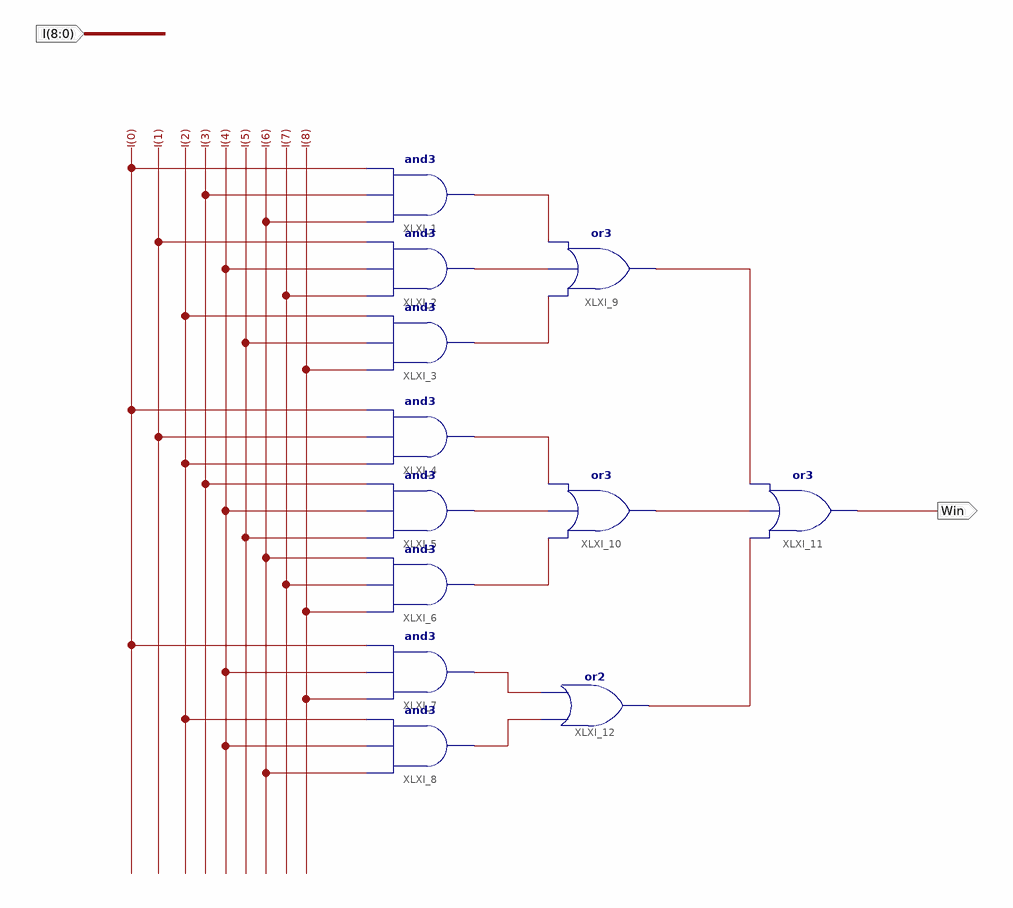
[diagram p0: schematic sheet 1]
// Xilinx ISE schematic checkWin.sch (spartan6) as structural Verilog: 12 symbols, 2 ports
module checkWin (
  input  [8:0] I,
  output Win
);

  wire XLXN_35, XLXN_36, XLXN_39, XLXN_40, XLXN_41, XLXN_42, XLXN_43, XLXN_44, XLXN_45, XLXN_46, XLXN_47;

  and XLXI_1 (XLXN_35, I[6], I[3], I[0]);
  and XLXI_2 (XLXN_36, I[7], I[4], I[1]);
  and XLXI_3 (XLXN_39, I[8], I[5], I[2]);
  and XLXI_4 (XLXN_40, I[2], I[1], I[0]);
  and XLXI_5 (XLXN_41, I[5], I[4], I[3]);
  and XLXI_6 (XLXN_42, I[8], I[7], I[6]);
  and XLXI_7 (XLXN_43, I[8], I[4], I[0]);
  and XLXI_8 (XLXN_44, I[6], I[4], I[2]);
  or XLXI_9 (XLXN_47, XLXN_39, XLXN_36, XLXN_35);
  or XLXI_10 (XLXN_46, XLXN_42, XLXN_41, XLXN_40);
  or XLXI_11 (Win, XLXN_45, XLXN_46, XLXN_47);
  or XLXI_12 (XLXN_45, XLXN_44, XLXN_43);
endmodule
